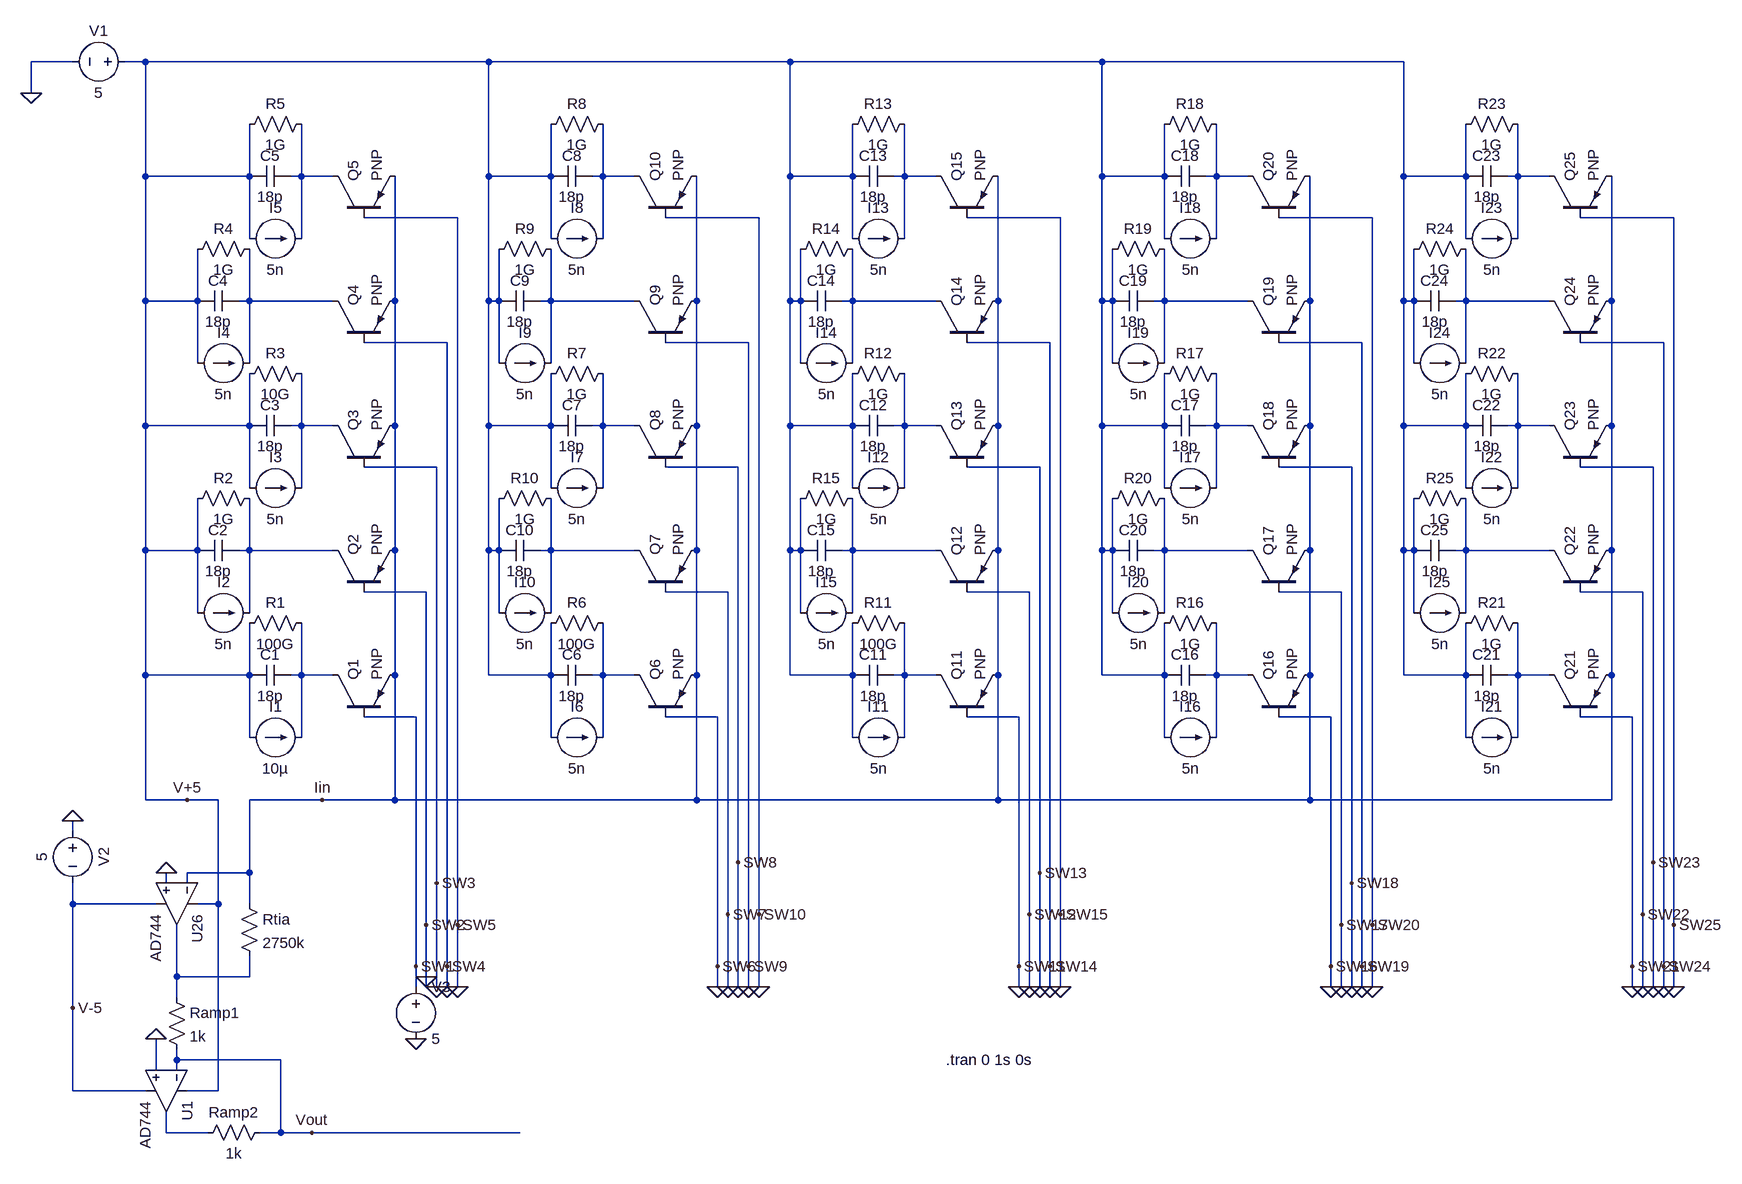
[diagram p0: schematic Schematic.asc]
Schematic.asc, the LTspice schematic file:
Version 4
SHEET 1 2420 1792
WIRE -96 0 -160 0
WIRE 16 0 -16 0
WIRE 544 0 16 0
WIRE 1008 0 544 0
WIRE 1488 0 1008 0
WIRE 1952 0 1488 0
WIRE -160 48 -160 0
WIRE 16 176 16 0
WIRE 176 176 176 96
WIRE 176 176 16 176
WIRE 256 176 256 96
WIRE 256 176 240 176
WIRE 304 176 256 176
WIRE 544 176 544 0
WIRE 640 176 640 96
WIRE 640 176 544 176
WIRE 720 176 720 96
WIRE 720 176 704 176
WIRE 768 176 720 176
WIRE 1008 176 1008 0
WIRE 1104 176 1104 96
WIRE 1104 176 1008 176
WIRE 1184 176 1184 96
WIRE 1184 176 1168 176
WIRE 1232 176 1184 176
WIRE 1488 176 1488 0
WIRE 1584 176 1584 96
WIRE 1584 176 1488 176
WIRE 1664 176 1664 96
WIRE 1664 176 1648 176
WIRE 1712 176 1664 176
WIRE 1952 176 1952 0
WIRE 2048 176 2048 96
WIRE 2048 176 1952 176
WIRE 2128 176 2128 96
WIRE 2128 176 2112 176
WIRE 2176 176 2128 176
WIRE 496 240 352 240
WIRE 960 240 816 240
WIRE 1424 240 1280 240
WIRE 1904 240 1760 240
WIRE 2368 240 2224 240
WIRE 176 272 176 176
WIRE 256 272 256 176
WIRE 640 272 640 176
WIRE 720 272 720 176
WIRE 1104 272 1104 176
WIRE 1184 272 1184 176
WIRE 1584 272 1584 176
WIRE 1664 272 1664 176
WIRE 2048 272 2048 176
WIRE 2128 272 2128 176
WIRE 16 368 16 176
WIRE 96 368 96 288
WIRE 96 368 16 368
WIRE 176 368 176 288
WIRE 176 368 160 368
WIRE 304 368 176 368
WIRE 400 368 400 176
WIRE 544 368 544 176
WIRE 560 368 560 288
WIRE 560 368 544 368
WIRE 640 368 640 288
WIRE 640 368 624 368
WIRE 768 368 640 368
WIRE 864 368 864 176
WIRE 1008 368 1008 176
WIRE 1024 368 1024 288
WIRE 1024 368 1008 368
WIRE 1104 368 1104 288
WIRE 1104 368 1088 368
WIRE 1232 368 1104 368
WIRE 1328 368 1328 176
WIRE 1488 368 1488 176
WIRE 1504 368 1504 288
WIRE 1504 368 1488 368
WIRE 1584 368 1584 288
WIRE 1584 368 1568 368
WIRE 1712 368 1584 368
WIRE 1808 368 1808 176
WIRE 1952 368 1952 176
WIRE 1968 368 1968 288
WIRE 1968 368 1952 368
WIRE 2048 368 2048 288
WIRE 2048 368 2032 368
WIRE 2176 368 2048 368
WIRE 2272 368 2272 176
WIRE 480 432 352 432
WIRE 944 432 816 432
WIRE 1408 432 1280 432
WIRE 1888 432 1760 432
WIRE 2352 432 2224 432
WIRE 96 464 96 368
WIRE 176 464 176 368
WIRE 560 464 560 368
WIRE 640 464 640 368
WIRE 1024 464 1024 368
WIRE 1104 464 1104 368
WIRE 1504 464 1504 368
WIRE 1584 464 1584 368
WIRE 1968 464 1968 368
WIRE 2048 464 2048 368
WIRE 16 560 16 368
WIRE 176 560 176 480
WIRE 176 560 16 560
WIRE 256 560 256 480
WIRE 256 560 240 560
WIRE 304 560 256 560
WIRE 400 560 400 368
WIRE 544 560 544 368
WIRE 640 560 640 480
WIRE 640 560 544 560
WIRE 720 560 720 480
WIRE 720 560 704 560
WIRE 768 560 720 560
WIRE 864 560 864 368
WIRE 1008 560 1008 368
WIRE 1104 560 1104 480
WIRE 1104 560 1008 560
WIRE 1184 560 1184 480
WIRE 1184 560 1168 560
WIRE 1232 560 1184 560
WIRE 1328 560 1328 368
WIRE 1488 560 1488 368
WIRE 1584 560 1584 480
WIRE 1584 560 1488 560
WIRE 1664 560 1664 480
WIRE 1664 560 1648 560
WIRE 1712 560 1664 560
WIRE 1808 560 1808 368
WIRE 1952 560 1952 368
WIRE 2048 560 2048 480
WIRE 2048 560 1952 560
WIRE 2128 560 2128 480
WIRE 2128 560 2112 560
WIRE 2176 560 2128 560
WIRE 2272 560 2272 368
WIRE 464 624 352 624
WIRE 928 624 816 624
WIRE 1392 624 1280 624
WIRE 1872 624 1760 624
WIRE 2336 624 2224 624
WIRE 176 656 176 560
WIRE 256 656 256 560
WIRE 640 656 640 560
WIRE 720 656 720 560
WIRE 1104 656 1104 560
WIRE 1184 656 1184 560
WIRE 1584 656 1584 560
WIRE 1664 656 1664 560
WIRE 2048 656 2048 560
WIRE 2128 656 2128 560
WIRE 16 752 16 560
WIRE 96 752 96 672
WIRE 96 752 16 752
WIRE 176 752 176 672
WIRE 176 752 160 752
WIRE 304 752 176 752
WIRE 400 752 400 560
WIRE 544 752 544 560
WIRE 560 752 560 672
WIRE 560 752 544 752
WIRE 640 752 640 672
WIRE 640 752 624 752
WIRE 768 752 640 752
WIRE 864 752 864 560
WIRE 1008 752 1008 560
WIRE 1024 752 1024 672
WIRE 1024 752 1008 752
WIRE 1104 752 1104 672
WIRE 1104 752 1088 752
WIRE 1232 752 1104 752
WIRE 1328 752 1328 560
WIRE 1488 752 1488 560
WIRE 1504 752 1504 672
WIRE 1504 752 1488 752
WIRE 1584 752 1584 672
WIRE 1584 752 1568 752
WIRE 1712 752 1584 752
WIRE 1808 752 1808 560
WIRE 1952 752 1952 560
WIRE 1968 752 1968 672
WIRE 1968 752 1952 752
WIRE 2048 752 2048 672
WIRE 2048 752 2032 752
WIRE 2176 752 2048 752
WIRE 2272 752 2272 560
WIRE 448 816 352 816
WIRE 912 816 816 816
WIRE 1376 816 1280 816
WIRE 1856 816 1760 816
WIRE 2320 816 2224 816
WIRE 96 848 96 752
WIRE 176 848 176 752
WIRE 560 848 560 752
WIRE 640 848 640 752
WIRE 1024 848 1024 752
WIRE 1104 848 1104 752
WIRE 1504 848 1504 752
WIRE 1584 848 1584 752
WIRE 1968 848 1968 752
WIRE 2048 848 2048 752
WIRE 16 944 16 752
WIRE 176 944 176 864
WIRE 176 944 16 944
WIRE 256 944 256 864
WIRE 256 944 240 944
WIRE 304 944 256 944
WIRE 400 944 400 752
WIRE 544 944 544 752
WIRE 640 944 640 864
WIRE 640 944 544 944
WIRE 720 944 720 864
WIRE 720 944 704 944
WIRE 768 944 720 944
WIRE 864 944 864 752
WIRE 1008 944 1008 752
WIRE 1104 944 1104 864
WIRE 1104 944 1008 944
WIRE 1184 944 1184 864
WIRE 1184 944 1168 944
WIRE 1232 944 1184 944
WIRE 1328 944 1328 752
WIRE 1488 944 1488 752
WIRE 1584 944 1584 864
WIRE 1584 944 1488 944
WIRE 1664 944 1664 864
WIRE 1664 944 1648 944
WIRE 1712 944 1664 944
WIRE 1808 944 1808 752
WIRE 1952 944 1952 752
WIRE 2048 944 2048 864
WIRE 2048 944 1952 944
WIRE 2128 944 2128 864
WIRE 2128 944 2112 944
WIRE 2176 944 2128 944
WIRE 2272 944 2272 752
WIRE 432 1008 352 1008
WIRE 896 1008 816 1008
WIRE 1360 1008 1280 1008
WIRE 1840 1008 1760 1008
WIRE 2304 1008 2224 1008
WIRE 176 1040 176 944
WIRE 256 1040 256 944
WIRE 640 1040 640 944
WIRE 720 1040 720 944
WIRE 1104 1040 1104 944
WIRE 1184 1040 1184 944
WIRE 1584 1040 1584 944
WIRE 1664 1040 1664 944
WIRE 2048 1040 2048 944
WIRE 2128 1040 2128 944
WIRE 16 1136 16 944
WIRE 80 1136 16 1136
WIRE 128 1136 80 1136
WIRE 288 1136 176 1136
WIRE 400 1136 400 944
WIRE 400 1136 288 1136
WIRE 864 1136 864 944
WIRE 864 1136 400 1136
WIRE 1328 1136 1328 944
WIRE 1328 1136 864 1136
WIRE 1808 1136 1808 944
WIRE 1808 1136 1328 1136
WIRE 2272 1136 2272 944
WIRE 2272 1136 1808 1136
WIRE -96 1184 -96 1168
WIRE 928 1232 928 624
WIRE 2336 1232 2336 624
WIRE 176 1248 176 1136
WIRE 176 1248 80 1248
WIRE 1392 1248 1392 624
WIRE 48 1264 48 1248
WIRE 80 1264 80 1248
WIRE 464 1264 464 624
WIRE 1872 1264 1872 624
WIRE -96 1296 -96 1264
WIRE 32 1296 -96 1296
WIRE 128 1296 128 1136
WIRE 128 1296 96 1296
WIRE 176 1296 176 1248
WIRE 912 1312 912 816
WIRE 960 1312 960 240
WIRE 1376 1312 1376 816
WIRE 1424 1312 1424 240
WIRE 2320 1312 2320 816
WIRE 448 1328 448 816
WIRE 496 1328 496 240
WIRE 1856 1328 1856 816
WIRE 1904 1328 1904 240
WIRE 2368 1328 2368 240
WIRE 432 1392 432 1008
WIRE 480 1392 480 432
WIRE 896 1392 896 1008
WIRE 944 1392 944 432
WIRE 1360 1392 1360 1008
WIRE 1408 1392 1408 432
WIRE 1840 1392 1840 1008
WIRE 1888 1392 1888 432
WIRE 2304 1392 2304 1008
WIRE 2352 1392 2352 432
WIRE 64 1408 64 1328
WIRE 176 1408 176 1376
WIRE 176 1408 64 1408
WIRE 448 1408 448 1328
WIRE 432 1424 432 1392
WIRE 448 1424 448 1408
WIRE 464 1424 464 1264
WIRE 480 1424 480 1392
WIRE 496 1424 496 1328
WIRE 896 1424 896 1392
WIRE 912 1424 912 1312
WIRE 928 1424 928 1232
WIRE 944 1424 944 1392
WIRE 960 1424 960 1312
WIRE 1360 1424 1360 1392
WIRE 1376 1424 1376 1312
WIRE 1392 1424 1392 1248
WIRE 1408 1424 1408 1392
WIRE 1424 1424 1424 1312
WIRE 1840 1424 1840 1392
WIRE 1856 1424 1856 1328
WIRE 1872 1424 1872 1264
WIRE 1888 1424 1888 1392
WIRE 1904 1424 1904 1328
WIRE 2304 1424 2304 1392
WIRE 2320 1424 2320 1312
WIRE 2336 1424 2336 1232
WIRE 2352 1424 2352 1392
WIRE 2368 1424 2368 1328
WIRE 64 1440 64 1408
WIRE -96 1456 -96 1296
WIRE 64 1536 64 1520
WIRE 224 1536 64 1536
WIRE 32 1552 32 1504
WIRE 64 1552 64 1536
WIRE -96 1584 -96 1456
WIRE 16 1584 -96 1584
WIRE 128 1584 128 1296
WIRE 128 1584 80 1584
WIRE 48 1648 48 1616
WIRE 112 1648 48 1648
WIRE 224 1648 224 1536
WIRE 224 1648 192 1648
WIRE 272 1648 224 1648
WIRE 592 1648 272 1648
FLAG 48 1248 0
FLAG -160 48 0
FLAG -96 1168 0
FLAG 432 1392 SW1
FLAG 448 1328 SW2
FLAG 464 1264 SW3
FLAG 480 1392 SW4
FLAG 496 1328 SW5
FLAG 896 1392 SW6
FLAG 912 1312 SW7
FLAG 928 1232 SW8
FLAG 944 1392 SW9
FLAG 960 1312 SW10
FLAG 1360 1392 SW11
FLAG 1376 1312 SW12
FLAG 1392 1248 SW13
FLAG 1408 1392 SW14
FLAG 1424 1312 SW15
FLAG 1840 1392 SW16
FLAG 1856 1328 SW17
FLAG 1872 1264 SW18
FLAG 1888 1392 SW19
FLAG 1904 1328 SW20
FLAG 2304 1392 SW21
FLAG 2352 1392 SW24
FLAG 2368 1328 SW25
FLAG 2320 1312 SW22
FLAG 2336 1232 SW23
FLAG 448 1408 0
FLAG 464 1424 0
FLAG 480 1424 0
FLAG 496 1424 0
FLAG 896 1424 0
FLAG 912 1424 0
FLAG 928 1424 0
FLAG 944 1424 0
FLAG 960 1424 0
FLAG 1360 1424 0
FLAG 1376 1424 0
FLAG 1392 1424 0
FLAG 1408 1424 0
FLAG 1424 1424 0
FLAG 1840 1424 0
FLAG 1856 1424 0
FLAG 1872 1424 0
FLAG 1888 1424 0
FLAG 1904 1424 0
FLAG 2304 1424 0
FLAG 2320 1424 0
FLAG 2336 1424 0
FLAG 2368 1424 0
FLAG 2352 1424 0
FLAG 32 1504 0
FLAG 272 1648 Vout
FLAG 432 1504 0
FLAG 80 1136 V+5
FLAG -96 1456 V-5
FLAG 288 1136 Iin
SYMBOL voltage 0 0 R90
WINDOW 0 -32 56 VBottom 2
WINDOW 3 32 56 VTop 2
WINDOW 123 0 0 Left 0
WINDOW 39 0 0 Left 0
SYMATTR InstName V1
SYMATTR Value 5
SYMBOL Opamps\\AD744 128 1296 R90
SYMATTR InstName U26
SYMBOL voltage -96 1168 R0
WINDOW 0 32 56 VTop 2
WINDOW 3 -32 56 VBottom 2
WINDOW 123 0 0 Left 0
WINDOW 39 0 0 Left 0
SYMATTR InstName V2
SYMATTR Value 5
SYMBOL res 160 1280 R0
SYMATTR InstName Rtia
SYMATTR Value 2750k
SYMBOL current 176 1040 R270
WINDOW 0 32 40 VTop 2
WINDOW 3 -32 40 VBottom 2
WINDOW 123 0 0 Left 0
WINDOW 39 0 0 Left 0
SYMATTR InstName I1
SYMATTR Value 10µ
SYMBOL cap 240 928 R90
WINDOW 0 0 32 VBottom 2
WINDOW 3 32 32 VTop 2
SYMATTR InstName C1
SYMATTR Value 18p
SYMBOL res 272 848 R90
WINDOW 0 0 56 VBottom 2
WINDOW 3 32 56 VTop 2
SYMATTR InstName R1
SYMATTR Value 100G
SYMBOL current 96 848 R270
WINDOW 0 32 40 VTop 2
WINDOW 3 -32 40 VBottom 2
WINDOW 123 0 0 Left 0
WINDOW 39 0 0 Left 0
SYMATTR InstName I2
SYMATTR Value 5n
SYMBOL cap 160 736 R90
WINDOW 0 0 32 VBottom 2
WINDOW 3 32 32 VTop 2
SYMATTR InstName C2
SYMATTR Value 18p
SYMBOL res 192 656 R90
WINDOW 0 0 56 VBottom 2
WINDOW 3 32 56 VTop 2
SYMATTR InstName R2
SYMATTR Value 1G
SYMBOL current 176 656 R270
WINDOW 0 32 40 VTop 2
WINDOW 3 -32 40 VBottom 2
WINDOW 123 0 0 Left 0
WINDOW 39 0 0 Left 0
SYMATTR InstName I3
SYMATTR Value 5n
SYMBOL cap 240 544 R90
WINDOW 0 0 32 VBottom 2
WINDOW 3 32 32 VTop 2
SYMATTR InstName C3
SYMATTR Value 18p
SYMBOL res 272 464 R90
WINDOW 0 0 56 VBottom 2
WINDOW 3 32 56 VTop 2
SYMATTR InstName R3
SYMATTR Value 10G
SYMBOL current 96 464 R270
WINDOW 0 32 40 VTop 2
WINDOW 3 -32 40 VBottom 2
WINDOW 123 0 0 Left 0
WINDOW 39 0 0 Left 0
SYMATTR InstName I4
SYMATTR Value 5n
SYMBOL cap 160 352 R90
WINDOW 0 0 32 VBottom 2
WINDOW 3 32 32 VTop 2
SYMATTR InstName C4
SYMATTR Value 18p
SYMBOL res 192 272 R90
WINDOW 0 0 56 VBottom 2
WINDOW 3 32 56 VTop 2
SYMATTR InstName R4
SYMATTR Value 1G
SYMBOL current 176 272 R270
WINDOW 0 32 40 VTop 2
WINDOW 3 -32 40 VBottom 2
WINDOW 123 0 0 Left 0
WINDOW 39 0 0 Left 0
SYMATTR InstName I5
SYMATTR Value 5n
SYMBOL cap 240 160 R90
WINDOW 0 0 32 VBottom 2
WINDOW 3 32 32 VTop 2
SYMATTR InstName C5
SYMATTR Value 18p
SYMBOL res 272 80 R90
WINDOW 0 0 56 VBottom 2
WINDOW 3 32 56 VTop 2
SYMATTR InstName R5
SYMATTR Value 1G
SYMBOL current 640 1040 R270
WINDOW 0 32 40 VTop 2
WINDOW 3 -32 40 VBottom 2
WINDOW 123 0 0 Left 0
WINDOW 39 0 0 Left 0
SYMATTR InstName I6
SYMATTR Value 5n
SYMBOL cap 704 928 R90
WINDOW 0 0 32 VBottom 2
WINDOW 3 32 32 VTop 2
SYMATTR InstName C6
SYMATTR Value 18p
SYMBOL res 736 848 R90
WINDOW 0 0 56 VBottom 2
WINDOW 3 32 56 VTop 2
SYMATTR InstName R6
SYMATTR Value 100G
SYMBOL current 640 656 R270
WINDOW 0 32 40 VTop 2
WINDOW 3 -32 40 VBottom 2
WINDOW 123 0 0 Left 0
WINDOW 39 0 0 Left 0
SYMATTR InstName I7
SYMATTR Value 5n
SYMBOL cap 704 544 R90
WINDOW 0 0 32 VBottom 2
WINDOW 3 32 32 VTop 2
SYMATTR InstName C7
SYMATTR Value 18p
SYMBOL res 736 464 R90
WINDOW 0 0 56 VBottom 2
WINDOW 3 32 56 VTop 2
SYMATTR InstName R7
SYMATTR Value 1G
SYMBOL current 640 272 R270
WINDOW 0 32 40 VTop 2
WINDOW 3 -32 40 VBottom 2
WINDOW 123 0 0 Left 0
WINDOW 39 0 0 Left 0
SYMATTR InstName I8
SYMATTR Value 5n
SYMBOL cap 704 160 R90
WINDOW 0 0 32 VBottom 2
WINDOW 3 32 32 VTop 2
SYMATTR InstName C8
SYMATTR Value 18p
SYMBOL res 736 80 R90
WINDOW 0 0 56 VBottom 2
WINDOW 3 32 56 VTop 2
SYMATTR InstName R8
SYMATTR Value 1G
SYMBOL current 560 464 R270
WINDOW 0 32 40 VTop 2
WINDOW 3 -32 40 VBottom 2
WINDOW 123 0 0 Left 0
WINDOW 39 0 0 Left 0
SYMATTR InstName I9
SYMATTR Value 5n
SYMBOL cap 624 352 R90
WINDOW 0 0 32 VBottom 2
WINDOW 3 32 32 VTop 2
SYMATTR InstName C9
SYMATTR Value 18p
SYMBOL res 656 272 R90
WINDOW 0 0 56 VBottom 2
WINDOW 3 32 56 VTop 2
SYMATTR InstName R9
SYMATTR Value 1G
SYMBOL current 560 848 R270
WINDOW 0 32 40 VTop 2
WINDOW 3 -32 40 VBottom 2
WINDOW 123 0 0 Left 0
WINDOW 39 0 0 Left 0
SYMATTR InstName I10
SYMATTR Value 5n
SYMBOL cap 624 736 R90
WINDOW 0 0 32 VBottom 2
WINDOW 3 32 32 VTop 2
SYMATTR InstName C10
SYMATTR Value 18p
SYMBOL res 656 656 R90
WINDOW 0 0 56 VBottom 2
WINDOW 3 32 56 VTop 2
SYMATTR InstName R10
SYMATTR Value 1G
SYMBOL current 1104 1040 R270
WINDOW 0 32 40 VTop 2
WINDOW 3 -32 40 VBottom 2
WINDOW 123 0 0 Left 0
WINDOW 39 0 0 Left 0
SYMATTR InstName I11
SYMATTR Value 5n
SYMBOL cap 1168 928 R90
WINDOW 0 0 32 VBottom 2
WINDOW 3 32 32 VTop 2
SYMATTR InstName C11
SYMATTR Value 18p
SYMBOL res 1200 848 R90
WINDOW 0 0 56 VBottom 2
WINDOW 3 32 56 VTop 2
SYMATTR InstName R11
SYMATTR Value 100G
SYMBOL current 1104 656 R270
WINDOW 0 32 40 VTop 2
WINDOW 3 -32 40 VBottom 2
WINDOW 123 0 0 Left 0
WINDOW 39 0 0 Left 0
SYMATTR InstName I12
SYMATTR Value 5n
SYMBOL cap 1168 544 R90
WINDOW 0 0 32 VBottom 2
WINDOW 3 32 32 VTop 2
SYMATTR InstName C12
SYMATTR Value 18p
SYMBOL res 1200 464 R90
WINDOW 0 0 56 VBottom 2
WINDOW 3 32 56 VTop 2
SYMATTR InstName R12
SYMATTR Value 1G
SYMBOL current 1104 272 R270
WINDOW 0 32 40 VTop 2
WINDOW 3 -32 40 VBottom 2
WINDOW 123 0 0 Left 0
WINDOW 39 0 0 Left 0
SYMATTR InstName I13
SYMATTR Value 5n
SYMBOL cap 1168 160 R90
WINDOW 0 0 32 VBottom 2
WINDOW 3 32 32 VTop 2
SYMATTR InstName C13
SYMATTR Value 18p
SYMBOL res 1200 80 R90
WINDOW 0 0 56 VBottom 2
WINDOW 3 32 56 VTop 2
SYMATTR InstName R13
SYMATTR Value 1G
SYMBOL current 1024 464 R270
WINDOW 0 32 40 VTop 2
WINDOW 3 -32 40 VBottom 2
WINDOW 123 0 0 Left 0
WINDOW 39 0 0 Left 0
SYMATTR InstName I14
SYMATTR Value 5n
SYMBOL cap 1088 352 R90
WINDOW 0 0 32 VBottom 2
WINDOW 3 32 32 VTop 2
SYMATTR InstName C14
SYMATTR Value 18p
SYMBOL res 1120 272 R90
WINDOW 0 0 56 VBottom 2
WINDOW 3 32 56 VTop 2
SYMATTR InstName R14
SYMATTR Value 1G
SYMBOL current 1024 848 R270
WINDOW 0 32 40 VTop 2
WINDOW 3 -32 40 VBottom 2
WINDOW 123 0 0 Left 0
WINDOW 39 0 0 Left 0
SYMATTR InstName I15
SYMATTR Value 5n
SYMBOL cap 1088 736 R90
WINDOW 0 0 32 VBottom 2
WINDOW 3 32 32 VTop 2
SYMATTR InstName C15
SYMATTR Value 18p
SYMBOL res 1120 656 R90
WINDOW 0 0 56 VBottom 2
WINDOW 3 32 56 VTop 2
SYMATTR InstName R15
SYMATTR Value 1G
SYMBOL current 1584 1040 R270
WINDOW 0 32 40 VTop 2
WINDOW 3 -32 40 VBottom 2
WINDOW 123 0 0 Left 0
WINDOW 39 0 0 Left 0
SYMATTR InstName I16
SYMATTR Value 5n
SYMBOL cap 1648 928 R90
WINDOW 0 0 32 VBottom 2
WINDOW 3 32 32 VTop 2
SYMATTR InstName C16
SYMATTR Value 18p
SYMBOL res 1680 848 R90
WINDOW 0 0 56 VBottom 2
WINDOW 3 32 56 VTop 2
SYMATTR InstName R16
SYMATTR Value 1G
SYMBOL current 1584 656 R270
WINDOW 0 32 40 VTop 2
WINDOW 3 -32 40 VBottom 2
WINDOW 123 0 0 Left 0
WINDOW 39 0 0 Left 0
SYMATTR InstName I17
SYMATTR Value 5n
SYMBOL cap 1648 544 R90
WINDOW 0 0 32 VBottom 2
WINDOW 3 32 32 VTop 2
SYMATTR InstName C17
SYMATTR Value 18p
SYMBOL res 1680 464 R90
WINDOW 0 0 56 VBottom 2
WINDOW 3 32 56 VTop 2
SYMATTR InstName R17
SYMATTR Value 1G
SYMBOL current 1584 272 R270
WINDOW 0 32 40 VTop 2
WINDOW 3 -32 40 VBottom 2
WINDOW 123 0 0 Left 0
WINDOW 39 0 0 Left 0
SYMATTR InstName I18
SYMATTR Value 5n
SYMBOL cap 1648 160 R90
WINDOW 0 0 32 VBottom 2
WINDOW 3 32 32 VTop 2
SYMATTR InstName C18
SYMATTR Value 18p
SYMBOL res 1680 80 R90
WINDOW 0 0 56 VBottom 2
WINDOW 3 32 56 VTop 2
SYMATTR InstName R18
SYMATTR Value 1G
SYMBOL current 1504 464 R270
WINDOW 0 32 40 VTop 2
WINDOW 3 -32 40 VBottom 2
WINDOW 123 0 0 Left 0
WINDOW 39 0 0 Left 0
SYMATTR InstName I19
SYMATTR Value 5n
SYMBOL cap 1568 352 R90
WINDOW 0 0 32 VBottom 2
WINDOW 3 32 32 VTop 2
SYMATTR InstName C19
SYMATTR Value 18p
SYMBOL res 1600 272 R90
WINDOW 0 0 56 VBottom 2
WINDOW 3 32 56 VTop 2
SYMATTR InstName R19
SYMATTR Value 1G
SYMBOL current 1504 848 R270
WINDOW 0 32 40 VTop 2
WINDOW 3 -32 40 VBottom 2
WINDOW 123 0 0 Left 0
WINDOW 39 0 0 Left 0
SYMATTR InstName I20
SYMATTR Value 5n
SYMBOL cap 1568 736 R90
WINDOW 0 0 32 VBottom 2
WINDOW 3 32 32 VTop 2
SYMATTR InstName C20
SYMATTR Value 18p
SYMBOL res 1600 656 R90
WINDOW 0 0 56 VBottom 2
WINDOW 3 32 56 VTop 2
SYMATTR InstName R20
SYMATTR Value 1G
SYMBOL current 2048 1040 R270
WINDOW 0 32 40 VTop 2
WINDOW 3 -32 40 VBottom 2
WINDOW 123 0 0 Left 0
WINDOW 39 0 0 Left 0
SYMATTR InstName I21
SYMATTR Value 5n
SYMBOL cap 2112 928 R90
WINDOW 0 0 32 VBottom 2
WINDOW 3 32 32 VTop 2
SYMATTR InstName C21
SYMATTR Value 18p
SYMBOL res 2144 848 R90
WINDOW 0 0 56 VBottom 2
WINDOW 3 32 56 VTop 2
SYMATTR InstName R21
SYMATTR Value 1G
SYMBOL current 2048 656 R270
WINDOW 0 32 40 VTop 2
WINDOW 3 -32 40 VBottom 2
WINDOW 123 0 0 Left 0
WINDOW 39 0 0 Left 0
SYMATTR InstName I22
SYMATTR Value 5n
SYMBOL cap 2112 544 R90
WINDOW 0 0 32 VBottom 2
WINDOW 3 32 32 VTop 2
SYMATTR InstName C22
SYMATTR Value 18p
SYMBOL res 2144 464 R90
WINDOW 0 0 56 VBottom 2
WINDOW 3 32 56 VTop 2
SYMATTR InstName R22
SYMATTR Value 1G
SYMBOL current 2048 272 R270
WINDOW 0 32 40 VTop 2
WINDOW 3 -32 40 VBottom 2
WINDOW 123 0 0 Left 0
WINDOW 39 0 0 Left 0
SYMATTR InstName I23
SYMATTR Value 5n
SYMBOL cap 2112 160 R90
WINDOW 0 0 32 VBottom 2
WINDOW 3 32 32 VTop 2
SYMATTR InstName C23
SYMATTR Value 18p
SYMBOL res 2144 80 R90
WINDOW 0 0 56 VBottom 2
WINDOW 3 32 56 VTop 2
SYMATTR InstName R23
SYMATTR Value 1G
SYMBOL current 1968 464 R270
WINDOW 0 32 40 VTop 2
WINDOW 3 -32 40 VBottom 2
WINDOW 123 0 0 Left 0
WINDOW 39 0 0 Left 0
SYMATTR InstName I24
SYMATTR Value 5n
SYMBOL cap 2032 352 R90
WINDOW 0 0 32 VBottom 2
WINDOW 3 32 32 VTop 2
SYMATTR InstName C24
SYMATTR Value 18p
SYMBOL res 2064 272 R90
WINDOW 0 0 56 VBottom 2
WINDOW 3 32 56 VTop 2
SYMATTR InstName R24
SYMATTR Value 1G
SYMBOL current 1968 848 R270
WINDOW 0 32 40 VTop 2
WINDOW 3 -32 40 VBottom 2
WINDOW 123 0 0 Left 0
WINDOW 39 0 0 Left 0
SYMATTR InstName I25
SYMATTR Value 5n
SYMBOL cap 2032 736 R90
WINDOW 0 0 32 VBottom 2
WINDOW 3 32 32 VTop 2
SYMATTR InstName C25
SYMATTR Value 18p
SYMBOL res 2064 656 R90
WINDOW 0 0 56 VBottom 2
WINDOW 3 32 56 VTop 2
SYMATTR InstName R25
SYMATTR Value 1G
SYMBOL voltage 432 1408 R0
WINDOW 123 0 0 Left 0
WINDOW 39 0 0 Left 0
SYMATTR InstName V3
SYMATTR Value 5
SYMBOL Opamps\\AD744 112 1584 R90
SYMATTR InstName U1
SYMBOL res 48 1424 R0
SYMATTR InstName Ramp1
SYMATTR Value 1k
SYMBOL res 96 1664 R270
WINDOW 0 32 56 VTop 2
WINDOW 3 0 56 VBottom 2
SYMATTR InstName Ramp2
SYMATTR Value 1k
SYMBOL pnp 304 1008 R270
SYMATTR InstName Q1
SYMBOL pnp 304 816 R270
SYMATTR InstName Q2
SYMBOL pnp 304 624 R270
SYMATTR InstName Q3
SYMBOL pnp 304 432 R270
SYMATTR InstName Q4
SYMBOL pnp 304 240 R270
SYMATTR InstName Q5
SYMBOL pnp 768 1008 R270
SYMATTR InstName Q6
SYMBOL pnp 768 816 R270
SYMATTR InstName Q7
SYMBOL pnp 768 624 R270
SYMATTR InstName Q8
SYMBOL pnp 768 432 R270
SYMATTR InstName Q9
SYMBOL pnp 768 240 R270
SYMATTR InstName Q10
SYMBOL pnp 1232 1008 R270
SYMATTR InstName Q11
SYMBOL pnp 1232 816 R270
SYMATTR InstName Q12
SYMBOL pnp 1232 624 R270
SYMATTR InstName Q13
SYMBOL pnp 1232 432 R270
SYMATTR InstName Q14
SYMBOL pnp 1232 240 R270
SYMATTR InstName Q15
SYMBOL pnp 1712 1008 R270
SYMATTR InstName Q16
SYMBOL pnp 1712 816 R270
SYMATTR InstName Q17
SYMBOL pnp 1712 624 R270
SYMATTR InstName Q18
SYMBOL pnp 1712 432 R270
SYMATTR InstName Q19
SYMBOL pnp 1712 240 R270
SYMATTR InstName Q20
SYMBOL pnp 2176 1008 R270
SYMATTR InstName Q21
SYMBOL pnp 2176 816 R270
SYMATTR InstName Q22
SYMBOL pnp 2176 624 R270
SYMATTR InstName Q23
SYMBOL pnp 2176 432 R270
SYMATTR InstName Q24
SYMBOL pnp 2176 240 R270
SYMATTR InstName Q25
TEXT 1248 1536 Left 2 !.tran 0 1s 0s

The netlist it stands for:
* Schematic.asc
V1 V+5 0 5
XU26 0 Iin V+5 V-5 N026 AD744  ; pins In+ In- V+ V- OUT
V2 0 V-5 5
Rtia Iin N026 2750k
I1 V+5 N021 10µ
C1 N021 V+5 18p
R1 N021 V+5 100G
I2 V+5 N016 5n
C2 N016 V+5 18p
R2 N016 V+5 1G
I3 V+5 N011 5n
C3 N011 V+5 18p
R3 N011 V+5 10G
I4 V+5 N006 5n
C4 N006 V+5 18p
R4 N006 V+5 1G
I5 V+5 N001 5n
C5 N001 V+5 18p
R5 N001 V+5 1G
I6 V+5 N022 5n
C6 N022 V+5 18p
R6 N022 V+5 100G
I7 V+5 N012 5n
C7 N012 V+5 18p
R7 N012 V+5 1G
I8 V+5 N002 5n
C8 N002 V+5 18p
R8 N002 V+5 1G
I9 V+5 N007 5n
C9 N007 V+5 18p
R9 N007 V+5 1G
I10 V+5 N017 5n
C10 N017 V+5 18p
R10 N017 V+5 1G
I11 V+5 N023 5n
C11 N023 V+5 18p
R11 N023 V+5 100G
I12 V+5 N013 5n
C12 N013 V+5 18p
R12 N013 V+5 1G
I13 V+5 N003 5n
C13 N003 V+5 18p
R13 N003 V+5 1G
I14 V+5 N008 5n
C14 N008 V+5 18p
R14 N008 V+5 1G
I15 V+5 N018 5n
C15 N018 V+5 18p
R15 N018 V+5 1G
I16 V+5 N024 5n
C16 N024 V+5 18p
R16 N024 V+5 1G
I17 V+5 N014 5n
C17 N014 V+5 18p
R17 N014 V+5 1G
I18 V+5 N004 5n
C18 N004 V+5 18p
R18 N004 V+5 1G
I19 V+5 N009 5n
C19 N009 V+5 18p
R19 N009 V+5 1G
I20 V+5 N019 5n
C20 N019 V+5 18p
R20 N019 V+5 1G
I21 V+5 N025 5n
C21 N025 V+5 18p
R21 N025 V+5 1G
I22 V+5 N015 5n
C22 N015 V+5 18p
R22 N015 V+5 1G
I23 V+5 N005 5n
C23 N005 V+5 18p
R23 N005 V+5 1G
I24 V+5 N010 5n
C24 N010 V+5 18p
R24 N010 V+5 1G
I25 V+5 N020 5n
C25 N020 V+5 18p
R25 N020 V+5 1G
V3 SW1 0 5
XU1 0 Vout V+5 V-5 N027 AD744  ; pins In+ In- V+ V- OUT
Ramp1 N026 Vout 1k
Ramp2 N027 Vout 1k
Q1 N021 SW1 Iin 0 PNP
Q2 N016 0 Iin 0 PNP
Q3 N011 0 Iin 0 PNP
Q4 N006 0 Iin 0 PNP
Q5 N001 0 Iin 0 PNP
Q6 N022 0 Iin 0 PNP
Q7 N017 0 Iin 0 PNP
Q8 N012 0 Iin 0 PNP
Q9 N007 0 Iin 0 PNP
Q10 N002 0 Iin 0 PNP
Q11 N023 0 Iin 0 PNP
Q12 N018 0 Iin 0 PNP
Q13 N013 0 Iin 0 PNP
Q14 N008 0 Iin 0 PNP
Q15 N003 0 Iin 0 PNP
Q16 N024 0 Iin 0 PNP
Q17 N019 0 Iin 0 PNP
Q18 N014 0 Iin 0 PNP
Q19 N009 0 Iin 0 PNP
Q20 N004 0 Iin 0 PNP
Q21 N025 0 Iin 0 PNP
Q22 N020 0 Iin 0 PNP
Q23 N015 0 Iin 0 PNP
Q24 N010 0 Iin 0 PNP
Q25 N005 0 Iin 0 PNP
.model NPN NPN
.model PNP PNP
.lib standard.bjt
.tran 0 1s 0s
.backanno
.end